# EAGLE design UI (EAGLE 7.1.0)
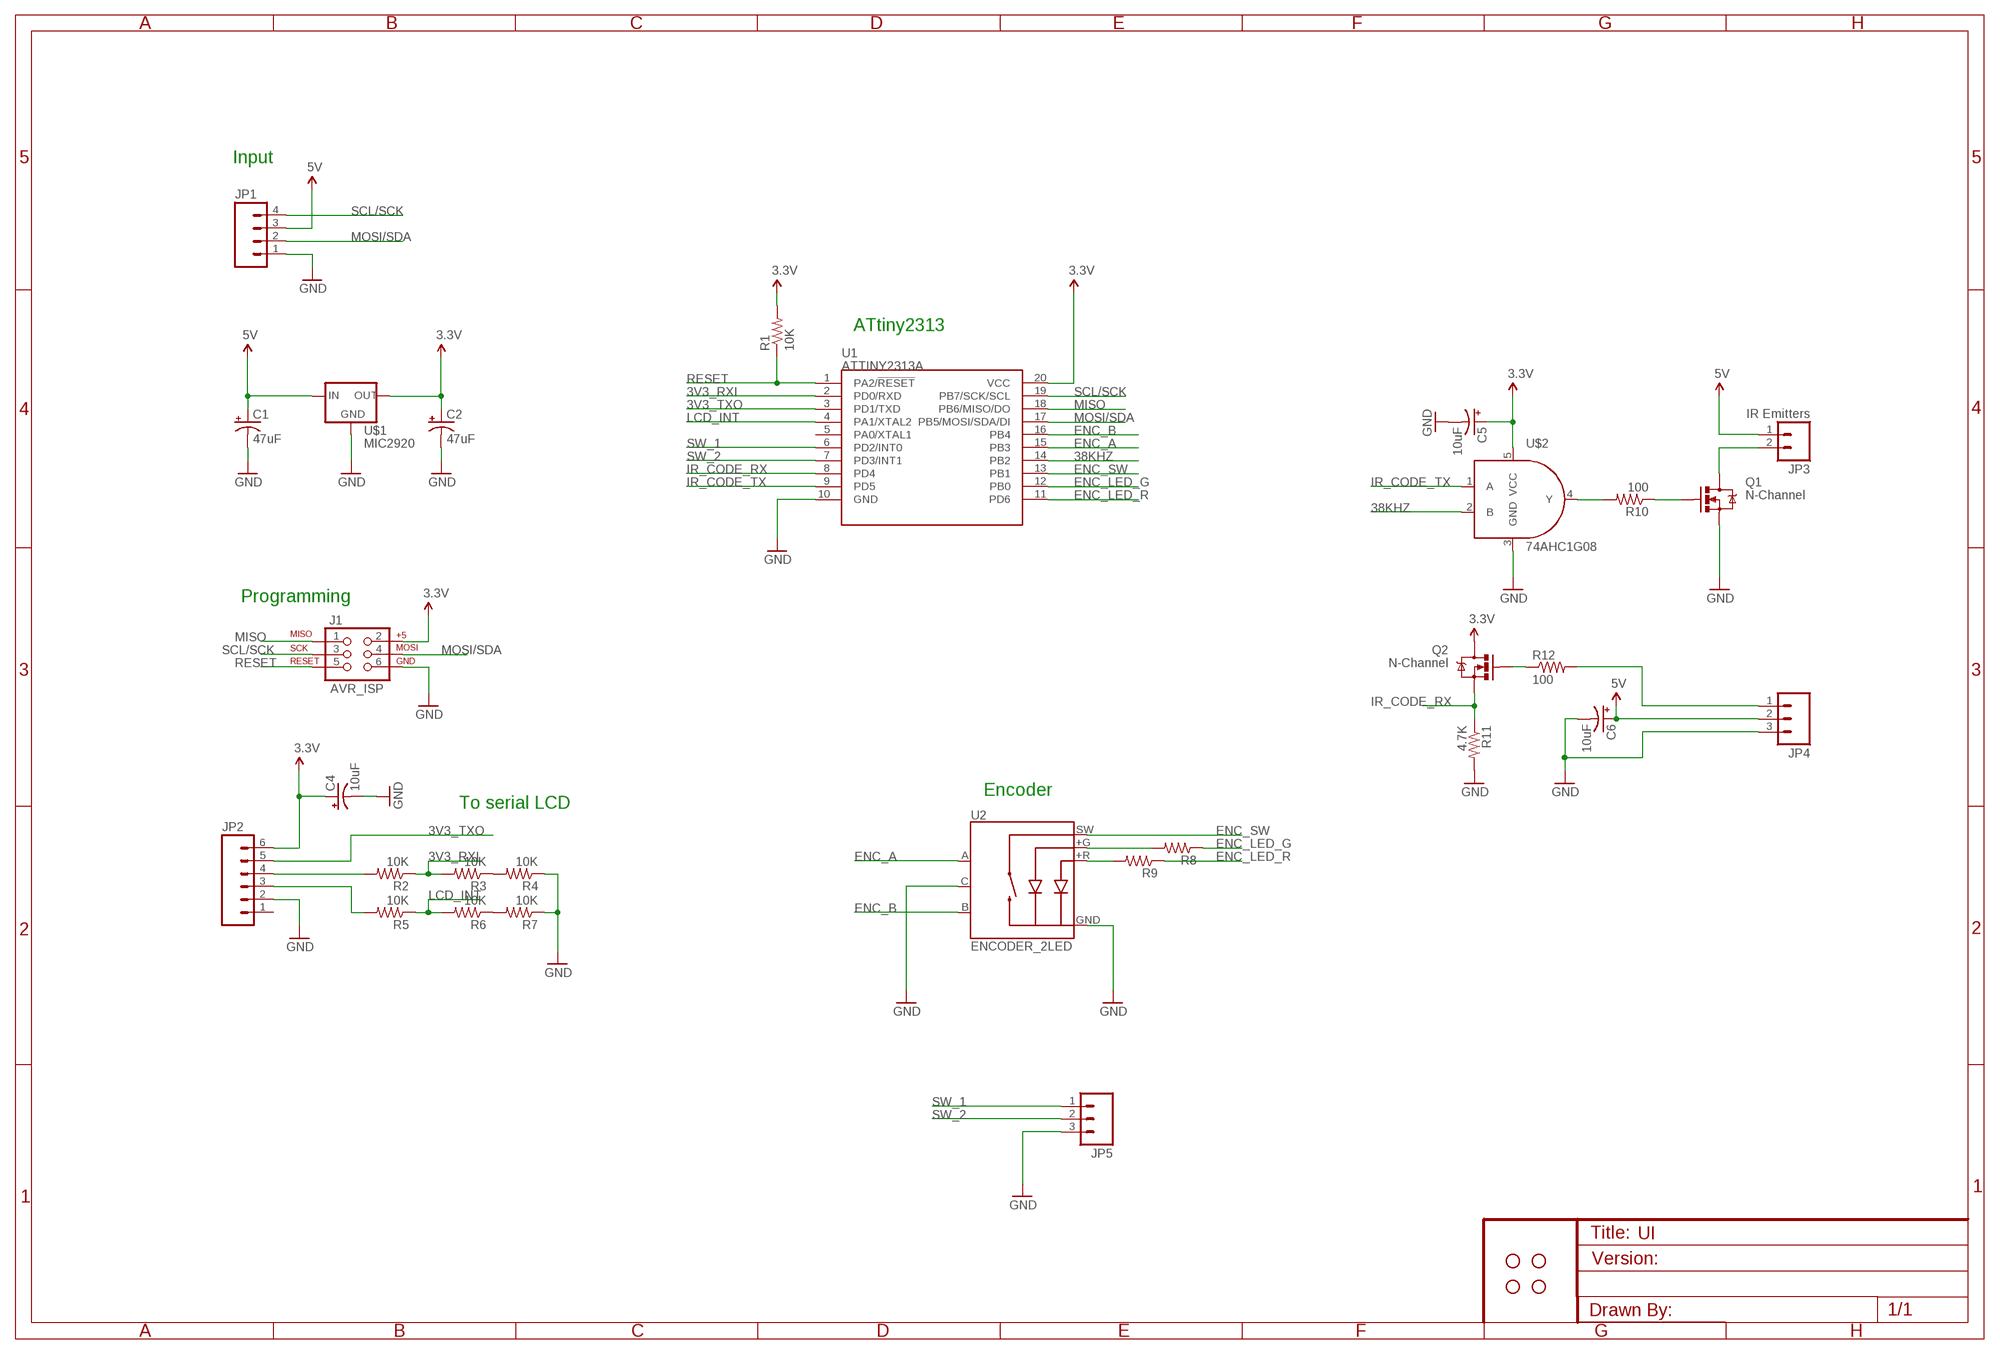
[diagram p0: schematic, sheet 1]

## Parts
C1  47uF  CAP_POLPTH2  [CPOL-RADIAL-10UF-25V]
C2  47uF  CAP_POLPTH2  [CPOL-RADIAL-10UF-25V]
C4  10uF  CAP_POL1206  [EIA3216]
C5  10uF  CAP_POL1206  [EIA3216]
C6  10uF  CAP_POL1206  [EIA3216]
J1  AVR_ISP  AVR_SPI_PRG_6PTH  [2X3]
JP1  M04POLAR  [MOLEX-1X4]
JP2  M06POLAR  [MOLEX-1X6]
JP3  IR Emitters  M023.5MM  [SCREWTERMINAL-3.5MM-2]
JP4  M03PTH  [1X03]
JP5  M03PTH  [1X03]
Q1  N-Channel  MOSFET-NCHANNELBSS138  [SOT23]
Q2  N-Channel  MOSFET-NCHANNELBSS138  [SOT23]
R1  10K  RESISTOR1206  [1206]
R2  10K  RESISTOR1206  [1206]
R3  10K  RESISTOR1206  [1206]
R4  10K  RESISTOR1206  [1206]
R5  10K  RESISTOR1206  [1206]
R6  10K  RESISTOR1206  [1206]
R7  10K  RESISTOR1206  [1206]
R8  RESISTOR1206  [1206]
R9  RESISTOR1206  [1206]
R10  100  RESISTOR1206  [1206]
R11  4.7K  RESISTOR1206  [1206]
R12  100  RESISTOR1206  [1206]
STANDOFF1  STAND-OFF  [STAND-OFF]
STANDOFF2  STAND-OFF  [STAND-OFF]
STANDOFF3  STAND-OFF  [STAND-OFF]
STANDOFF4  STAND-OFF  [STAND-OFF]
U1  ATTINY2313A  [SOP20W]
U2  ENCODER_2LED  [ENCODER_LED_2]
U$1  MIC2920  V_REG_MIC2920  [SOT223]
U$2  74AHC1G08  [SOT23-5]

## Nets
3.3V: C2.1(+) C4.A(+) C5.A(+) J1.2 JP2.6 Q2.3(D) R1.2 U1.20(VCC) U$1.3(OUT) U$2.5(VCC)
3V3_RXI: R2.1 R3.2 U1.2(PD0/RXD)
3V3_TXO: JP2.5 U1.3(PD1/TXD)
5V: C1.1(+) C6.A(+) JP1.3 JP3.1 JP4.2 U$1.1(IN)
38KHZ: U1.14(PB2) U$2.2(B)
ENC_A: U1.15(PB3) U2.A
ENC_B: U1.16(PB4) U2.B
ENC_LED_G: R8.1 U1.12(PB0)
ENC_LED_R: R9.1 U1.11(PD6)
ENC_SW: U1.13(PB1) U2.SW
GND: C1.2(-) C2.2(-) C4.C(-) C5.C(-) C6.C(-) J1.6 JP1.1 JP2.2 JP4.3 JP5.3 Q1.2(S) R4.1 R7.1 R11.2 U1.10(GND) U2.C U2.GND(-) U$1.2(GND) U$2.3(GND)
IR_CODE_RX: Q2.2(S) R11.1 U1.8(PD4)
IR_CODE_TX: U1.9(PD5) U$2.1(A)
LCD_INT: R5.1 R6.2 U1.4(PA1/XTAL2)
MISO: J1.1 U1.18(PB6/MISO/DO)
MOSI/SDA: J1.4 JP1.2 U1.17(PB5/MOSI/SDA/DI)
N$1: R8.2 U2.+G
N$2: R9.2 U2.+R
N$3: JP4.1 R12.2
N$4: JP2.4 R2.2
N$5: JP2.3 R5.2
N$6: R3.1 R4.2
N$7: R6.1 R7.2
N$8: JP3.2 Q1.3(D)
N$9: R10.2 U$2.4(Y)
N$10: Q1.1(G) R10.1
N$11: Q2.1(G) R12.1
RESET: J1.5 R1.1 U1.1(PA2/!RESET)
SCL/SCK: J1.3 JP1.4 U1.19(PB7/SCK/SCL)
SW_1: JP5.1 U1.6(PD2/INT0)
SW_2: JP5.2 U1.7(PD3/INT1)
Unconnected: JP2.1 U1.5(PA0/XTAL1)

## Notes on the sheet
- Input
- ATtiny2313
- Programming
- To serial LCD | Encoder

## Library data of the parts
C1 C2 C4-C6 = 1_SparkFun-Capacitors:CAP_POL: Capacitor Polarized These are standard SMD and PTH capacitors. Normally 10uF, 47uF, and 100uF in electrolytic and tantalum varieties. Always verify the external diameter of the through hole cap, it varies with capacity, voltage, and manufacturer. The EIA devices should be standard.
J1 = 1_SparkFun-Connectors:AVR_SPI_PRG_6: AVR ISP 6 Pin This is the reduced ISP connector for AVR programming. Common on Arduino. This footprint will take up less PCB space and can be used with a 10-pin to 6-pin adapter such as SKU: BOB-08508
JP1 = 1_SparkFun-Connectors:M04: Header 4 Standard 4-pin 0.1" header. Use with straight break away headers (SKU : PRT-00116), right angle break away headers (PRT-00553), swiss pins (PRT-00743), machine pins (PRT-00117), and female headers (PRT-00115). Molex polarized connector foot print use with SKU : PRT-08231 with associated crimp pins and housings. 1MM SMD Version SKU: PRT-10208
JP2 = 1_SparkFun-Connectors:M06: Header 6 Standard 6-pin 0.1" header. Use with straight break away headers (SKU : PRT-00116), right angle break away headers (PRT-00553), swiss pins (PRT-00743), machine pins (PRT-00117), and female headers (PRT-00115). Molex polarized connector foot print use with SKU : PRT-08094 with associated crimp pins and housings. NOTES ON THE VARIANTS LOCK and LOCK_LONGPADS... This footprint was designed to help hold the alignment of a through-hole component (i.e. 6-pin header) while soldering it into place. You may notice that each hole has been shifted either up or down by 0.005 of an inch from it's more standard position (which is a perfectly straight line). This slight alteration caused the pins (the squares in the middle) to touch the edges of the holes. Because they are alternating, it causes a "brace" to hold the component in place. 0.005 has proven to be the perfect amount of "off-center" position when using our standard breakaway headers. Although looks a little odd when you look at the bare footprint, once you have a header in there, the alteration is very hard to notice. Also,if you push a header all the way into place, it is covered up entirely on the bottom side. This idea of altering the position of holes to aid alignment will be further integrated into the Sparkfun Library for other footprints. It can help hold any component with 3 or more connection pins.
JP3 = 1_SparkFun-Connectors:M02: Standard 2-pin 0.1" header. Use with - straight break away headers ( PRT-00116) - right angle break away headers (PRT-00553) - swiss pins (PRT-00743) - machine pins (PRT-00117) - female headers (PRT-00115) Molex polarized connector foot print use with: PRT-08233 with associated crimp pins and housings. 2.54_SCREWTERM for use with PRT-10571. 3.5mm Screw Terminal footprints for PRT-08084 5mm Screw Terminal footprints for use with PRT-08433
JP4 JP5 = 1_SparkFun-Connectors:M03: Header 3 Standard 3-pin 0.1" header. Use with straight break away headers (SKU : PRT-00116), right angle break away headers (PRT-00553), swiss pins (PRT-00743), machine pins (PRT-00117), and female headers (PRT-00115). Molex polarized connector foot print use with SKU : PRT-08232 with associated crimp pins and housings.
Q1 Q2 = 1_SparkFun-DiscreteSemi:MOSFET-NCHANNEL: Common NMOSFET Parts MFG P/N Store ID Prod ID FDD8780 TRANS-09984 SI7820DN TRANS-11055 FDS6630A IC-08089 2N7002PW TRANS-11151 FQP30N06L COM-10213 TRANS-10060 BSS123LT1G TRANS-08345 BSS138 TRANS-00830 BS170 2N7000; PROD_ID: TRANS-00830
R1-R12 = 1_SparkFun-Resistors:RESISTOR: Resistor Basic schematic elements and footprints for 0603, 1206, and PTH resistors.
STANDOFF1-STANDOFF4 = 1_SparkFun-Electromechanical:STAND-OFF: #4 Stand Off This is the mechanical footprint for a #4 phillips button head screw. Use the keepout ring to avoid running the screw head into surrounding components. SKU : PRT-00447
U1 = 1_SparkFun-DigitalIC:ATTINY2313A: ATTINY2313A 2kB 20MHz I2C/SPI/UART; PROD_ID: IC-11305
U2 = 1_SparkFun-Electromechanical:ENCODER_2LED: Illuminated Rotary Encoder w/ 2 LEDs
U$1 = 1_SparkFun-PowerIC:V_REG_MIC2920: MIC2920A (http://www.micrel.com/_PDF/mic2920.pdf) - 400mA output LDO Regulator
U$2 = 1_SparkFun-DigitalIC:74AHC1G08: Single 2-input AND gate

## Board
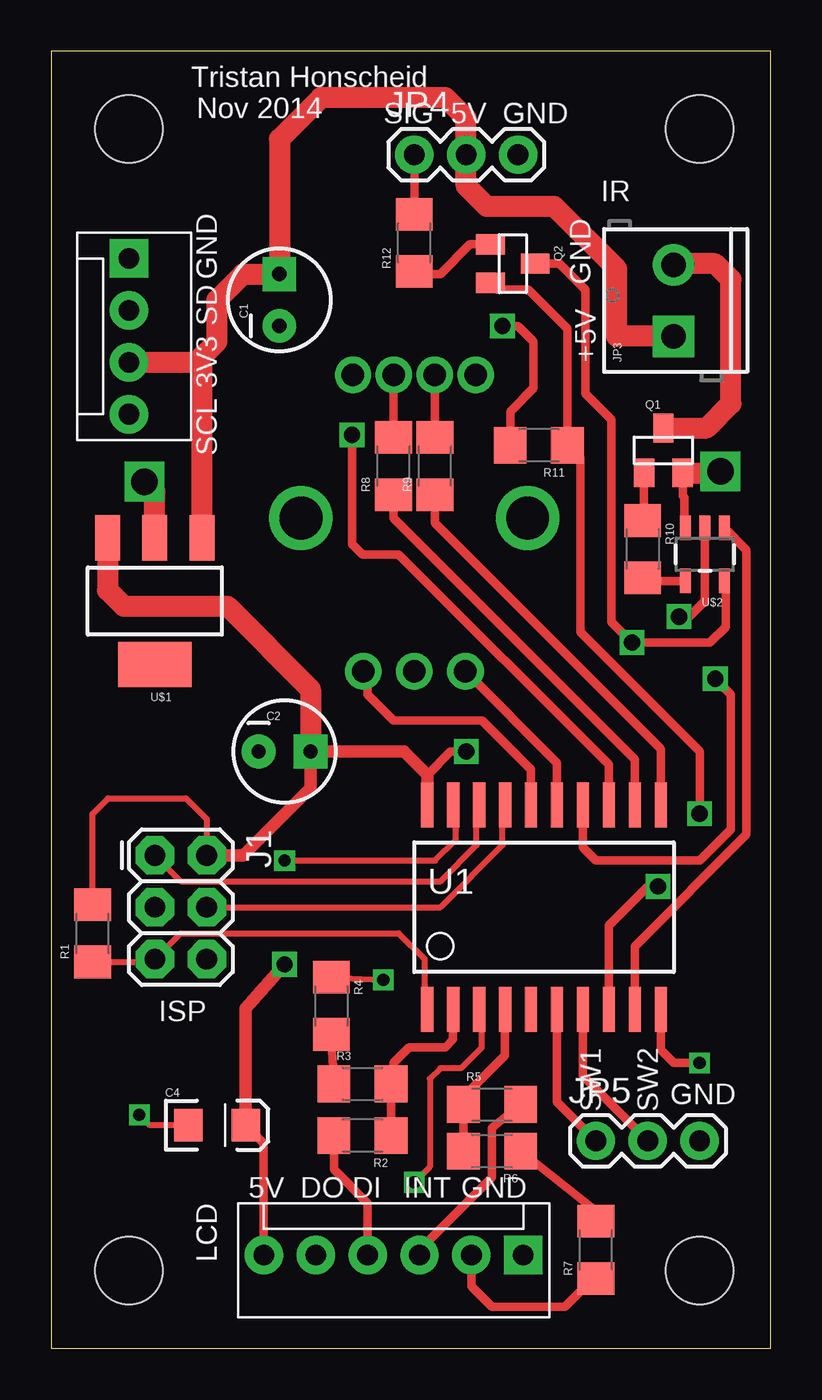
[diagram p1: board, top side]
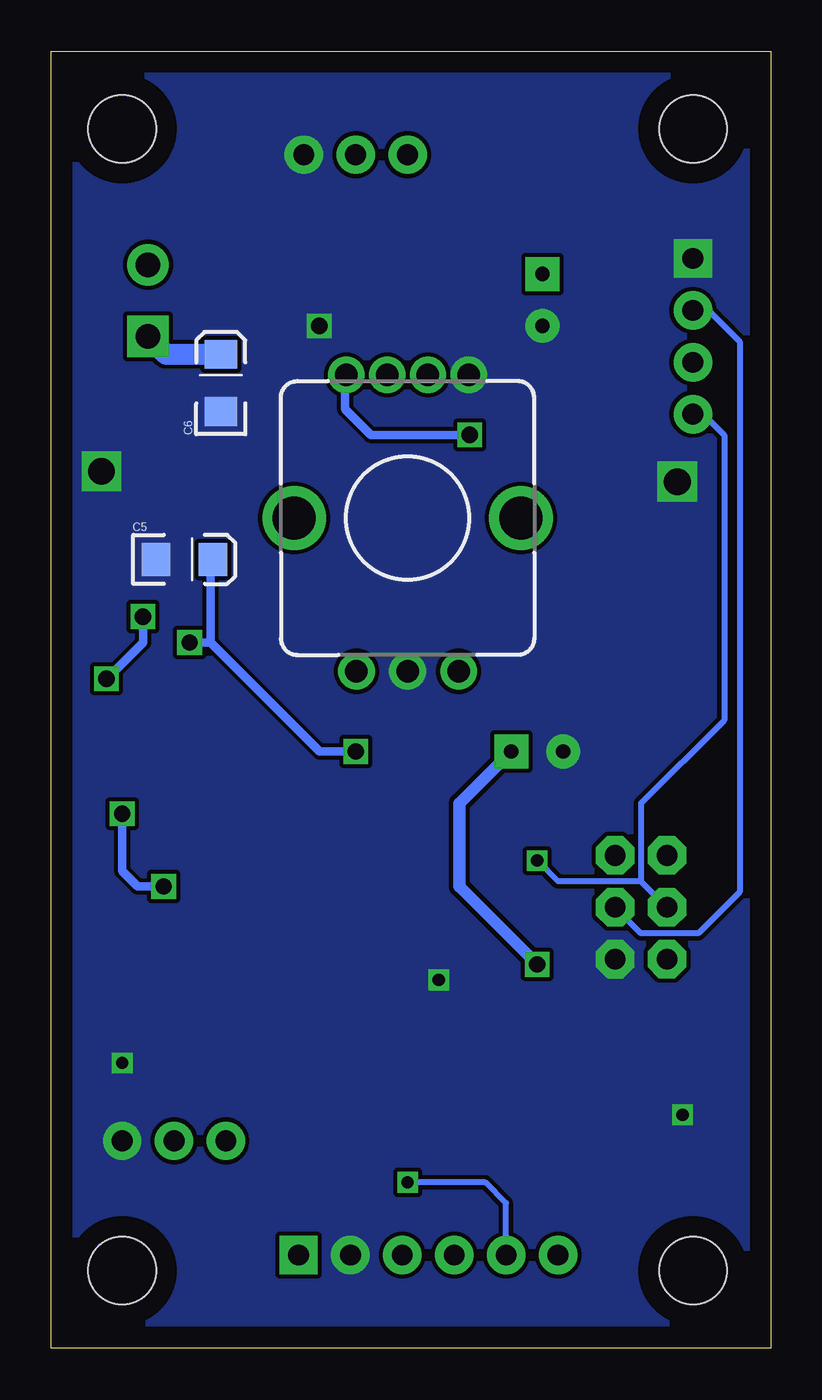
[diagram p2: board, bottom side, seen from below]

Size 35.23 x 63.49 mm. Coordinates in mm from the lower left corner, seen from the top.
Outline: 0,0 35.23,0 35.23,63.49 0,63.49 0,0
Copper layers (1*16): Top 0.035mm / dielectric 1.5mm / Bottom 0.035mm
Design rules "default": minimum track width 10mil, minimum drill 24mil, track to track 8mil, track to pad 8mil, pad to pad 8mil, via to via 8mil, smd to smd 8mil, copper to edge 40mil, drill to drill 8mil, minimum pad ring 10mil, minimum via ring 8mil, stop-mask expansion 4mil, vias tented up to drill 0mil, thermal gap 10mil

### Footprints (pad centres in the part's own frame; a part is rotated, then mirrored left to right if it is on the bottom)
CPOL-RADIAL-10UF-25V = drill 0.7 pad 1.651 square: 1 1.27,0 | drill 0.7 pad 1.651: 2 -1.27,0
EIA3216 = smd 1.4 x 1.6: A 1.4,0; C -1.4,0
2X3 = drill 1.016 pad 1.88 octagon: 1 0,0; 2 0,2.54; 3 2.54,0; 4 2.54,2.54; 5 5.08,0; 6 5.08,2.54
MOLEX-1X4 = drill 1.016 pad 1.88 square: 1 0,0 | drill 1.016 pad 1.88: 2 2.54,0; 3 5.08,0; 4 7.62,0
MOLEX-1X6 = drill 1.016 pad 1.88 square: 1 0,0 | drill 1.016 pad 1.88: 2 2.54,0; 3 5.08,0; 4 7.62,0; 5 10.16,0; 6 12.7,0
SCREWTERMINAL-3.5MM-2 = drill 1.2 pad 2.032 square: 1 0,0 | drill 1.2 pad 2.032: 2 3.5,0
1X03 = drill 1.016 pad 1.88: 1 0,0; 2 2.54,0; 3 5.08,0
SOT23 = smd 1 x 1.4: 1 -0.95,-1.1; 2 0.95,-1.1; 3 0,1.1
1206 = smd 1.6 x 1.8: 1 -1.4,0; 2 1.4,0
STAND-OFF = hole 3.302: 0,0
SOP20W = smd 0.6 x 2.2: 1 -5.715,-5; 2 -4.445,-5; 3 -3.175,-5; 4 -1.905,-5; 5 -0.635,-5; 6 0.635,-5; 7 1.905,-5; 8 3.175,-5; 9 4.445,-5; 10 5.715,-5; 11 5.715,5; 12 4.445,5; 13 3.175,5; 14 1.905,5; 15 0.635,5; 16 -0.635,5; 17 -1.905,5; 18 -3.175,5; 19 -4.445,5; 20 -5.715,5
ENCODER_LED_2 = drill 1.1 pad 1.778: +G 1,7; +R -1,7; GND 3,7; SW -3,7 | drill 1.1 pad 1.8: A -2.5,-7.5; B 2.5,-7.5; C 0,-7.5 | drill 2.1: P$1 -5.55,0; P$2 5.55,0
SOT223 = smd 1.219 x 2.235: 1 -2.311,-3.099; 2 0,-3.099; 3 2.311,-3.099 | smd 3.6 x 2.2: 4 0,3.099
SOT23-5 = smd 0.55 x 1.2: 1 -0.95,-1.3; 2 0,-1.3; 3 0.95,-1.3; 4 0.95,1.3; 5 -0.95,1.3

### Placement (x,y rotation side)
C1  11.18,51.31 90 top
C2  11.43,29.21 0 top
C4  8.13,10.92 0 top
C5  28.7,38.61 0 bottom
C6  26.92,47.24 90 bottom
J1  5.08,24.13 270 top
JP1  3.81,53.34 270 top
JP2  23.11,4.57 180 top
JP3  30.48,49.53 90 top
JP4  17.78,58.42 0 top
JP5  26.67,10.16 0 top
Q1  29.97,43.94 0 top
Q2  22.61,53.09 270 top
R1  2.03,20.32 90 top
R2  15.24,10.41 180 top
R3  15.24,12.95 0 top
R4  13.72,16.76 270 top
R5  21.59,11.94 0 top
R6  21.59,9.65 180 top
R7  26.67,4.83 90 top
R8  16.76,43.18 90 top
R9  18.8,43.18 90 top
R10  28.96,39.12 270 top
R11  23.88,44.2 180 top
R12  17.78,54.1 90 top
STANDOFF1  3.81,3.81 0 top
STANDOFF2  31.75,59.69 0 top
STANDOFF3  31.75,3.81 0 top
STANDOFF4  3.81,59.69 0 top
U1  24.13,21.59 0 top
U2  17.78,40.64 0 bottom
U$1  5.08,36.58 180 top
U$2  32,38.86 180 top

### Tracks (layer width: path | path; a pad name or v marks a point on that pad's centre or on a via)
3.3V  (via drill 0.8)
  Top 0.305: R1.2 2.03,26.16 2.79,26.92 6.6,26.92 7.62,25.91 J1.2
  Top 0.406: Q2.3 24.89,53.09 26.16,51.82 26.16,46.74 27.43,45.47 27.43,35.56 v28.45,34.54 32.26,34.54 33.02,35.31 33.02,37.5 U$2.5 | JP2.6 10.41,10.03 C4.A | 18.41,28.07 19.56,29.21 v20.32,29.21
  Top 0.61: J1.2 9.4,24.13 12.7,27.43 C2.1 17.27,29.21 18.41,28.07 U1.20 | C4.A 9.53,16.64 v11.43,18.8
  Top 1.016: U$1.3 2.77,37.11 3.56,36.32 8.64,36.32 12.7,32.26 C2.1
  Bottom 0.406: v20.32,29.21 22.1,29.21 27.43,34.54 | 27.43,34.54 27.43,38.48 C5.A | 27.43,34.54 v28.45,34.54
  Bottom 0.61: v11.43,18.8 15.24,22.61 15.24,26.67 C2.1
3V3_RXI
  Top 0.406: R2.1 R3.2 | R3.2 16.64,13.08 17.02,13.46 17.02,13.33 R3.2 | U1.2 19.68,15.11 19.3,14.73 17.53,14.73 16.76,13.97 16.76,13.08 R3.2
3V3_TXO  (via drill 0.6)
  Top 0.305: U1.3 21.08,16.46 21.08,14.73 20.07,13.72 19.05,13.72 18.54,13.21 18.54,8.89 v17.78,8.13
  Bottom 0.305: JP2.5 12.95,7.11 13.97,8.13 v17.78,8.13
5V
  Top 1.016: JP1.3 7.11,48.26 | 7.11,48.26 8.13,49.28 8.13,51.31 9.4,52.58 C1.1 11.18,59.18 13.21,61.21 19.3,61.21 20.32,60.2 JP4.2 20.32,56.9 21.34,55.88 24.64,55.88 27.69,52.83 27.69,49.53 JP3.1 | U$1.1 7.39,47.98 7.11,48.26
  Bottom 1.016: C6.A 29.59,48.64 JP3.1
38KHZ  (via drill 0.8)
  Top 0.406: U1.14 26.04,24.51 26.67,23.88 31.75,23.88 33.27,25.4 33.27,32 v32.51,32.77 | U$2.2 32,36.58 31.24,35.81 v30.73,35.81
  Bottom 0.406: v32.51,32.77 30.73,34.54 v30.73,35.81
ENC_A
  Top 0.406: U1.15 24.77,28.66 U2.A
ENC_B
  Top 0.406: U1.16 23.5,28.32 21.08,30.73 16.76,30.73 15.49,32 15.49,32.93
  Top 0.61: 15.49,32.93 U2.B
ENC_LED_G
  Top 0.406: U1.12 28.57,28.83 16.76,40.64 R8.1
ENC_LED_R
  Top 0.406: U1.11 29.84,29.34 18.8,40.39 R9.1
ENC_SW  (via drill 0.8)
  Top 0.406: U1.13 27.3,28.57 17.02,38.86 15.24,38.86 14.73,39.37 v14.73,44.7
  Bottom 0.406: v14.73,44.7 19.56,44.7 20.83,45.97 20.83,47.59 U2.SW
GND  (via drill 0.6, 0.8, 1.3)
  Top 0.305: C4.C 4.83,10.92 v4.32,11.43 | R4.1 v16.26,18.03
  Top 0.406: U1.10 29.84,14.61 30.48,13.97 v31.75,13.97 | Q1.2 30.92,41.72 30.99,41.66 30.99,40.23 U$2.3 | R7.1 26.54,3.43 25.15,2.03 21.59,2.03 20.57,3.05 JP2.2 | R11.2 22.48,45.84 23.62,46.99 23.62,49.28 22.86,50.04 v22.1,50.04
  Top 1.016: U$1.2 5.08,41.91 v4.57,42.42 | Q1.2 32.68,42.84 v32.77,42.93
  pour Bottom (no thermals): 0,1.27 34.29,1.27 34.29,62.23 0,62.23
IR_CODE_RX  (via drill 0.8)
  Top 0.406: 21.34,51.97 Q2.2 21.83,51.82 23.37,51.82 25.28,49.91 R11.1 25.91,43.56 25.91,35.05 31.75,29.21 v31.75,26.16 | U1.8 27.3,20.7 29.21,22.61 v29.72,22.61
  Bottom 0.406: v29.72,22.61 30.99,22.61 31.75,23.37 v31.75,26.16
IR_CODE_TX
  Top 0.406: U1.9 28.57,19.68 34.04,25.15 34.04,39.08 U$2.1
LCD_INT
  Top 0.406: R6.2 R5.1 20.07,12.32 20.57,12.7 22.23,14.35 U1.4
MISO
  Top 0.305: J1.1 6.35,22.86 19.05,22.86 20.83,24.64 20.83,26.46 U1.18
MOSI/SDA
  Top 0.305: J1.4 19.05,21.59 22.1,24.64 22.1,26.46 U1.17
  Bottom 0.305: JP1.2 3.05,50.8 1.52,49.28 1.52,22.35 3.56,20.32 6.35,20.32 J1.4
N$1
  Top 0.406: R8.2 16.76,47.62
  Top 0.61: 16.76,47.62 U2.+G
N$2
  Top 0.406: R9.2 18.8,47.62
  Top 0.61: 18.8,47.62 U2.+R
N$3
  Top 0.406: JP4.1 R12.2
N$4
  Top 0.406: R2.2 13.84,8.77 15.49,7.11 JP2.4
N$5
  Top 0.406: JP2.3 18.03,4.83 21.59,8.38 21.59,10.79 R5.2
N$6
  Top 0.406: R4.2 R3.1
N$7
  Top 0.406: R7.2 26.67,6.73 R6.1
N$8
  Top 1.016: Q1.3 32.09,45.04 33.27,46.23 33.27,52.32 32.51,53.09 30.54,53.09 JP3.2
N$9
  Top 0.406: U$2.4 29.11,37.56 R10.2
N$10
  Top 0.406: Q1.1 29.02,40.58 R10.1
N$11
  Top 0.406: Q2.1 20.51,54.04 19.05,52.58 17.9,52.58 R12.1
RESET
  Top 0.305: U1.1 18.29,16.72 18.29,19.05 17.02,20.32 6.35,20.32 J1.5 4.95,18.92 R1.1
SCL/SCK  (via drill 0.6)
  Top 0.305: v11.43,23.88 18.8,23.88 19.81,24.89 19.81,26.46 U1.19
  Bottom 0.305: J1.3 6.35,22.86 | 6.35,22.86 10.41,22.86 v11.43,23.88 | JP1.4 3.3,45.72 2.29,44.7 2.29,30.73 6.35,26.67 6.35,22.86
SW_1
  Top 0.406: U1.6 24.77,12.06 JP5.1
SW_2
  Top 0.406: U1.7 26.04,13.34 JP5.2

### Text on the board
tPlace: Tristan Honscheid | Nov 2014 | SIG | 5V | GND | IR | GND | GND | SD | +5V | 3V3 | SCL | ISP | SW1 | SW2 | GND | LCD | 5V | DO | DI | INT | GND